# EasyEDA schematic SCH_EspBoy.json
TITLE: EspBoy; REV: 1.0; Date: 2025-10-07; Sheet: 1/1; Drawn By: Vítor Paixão
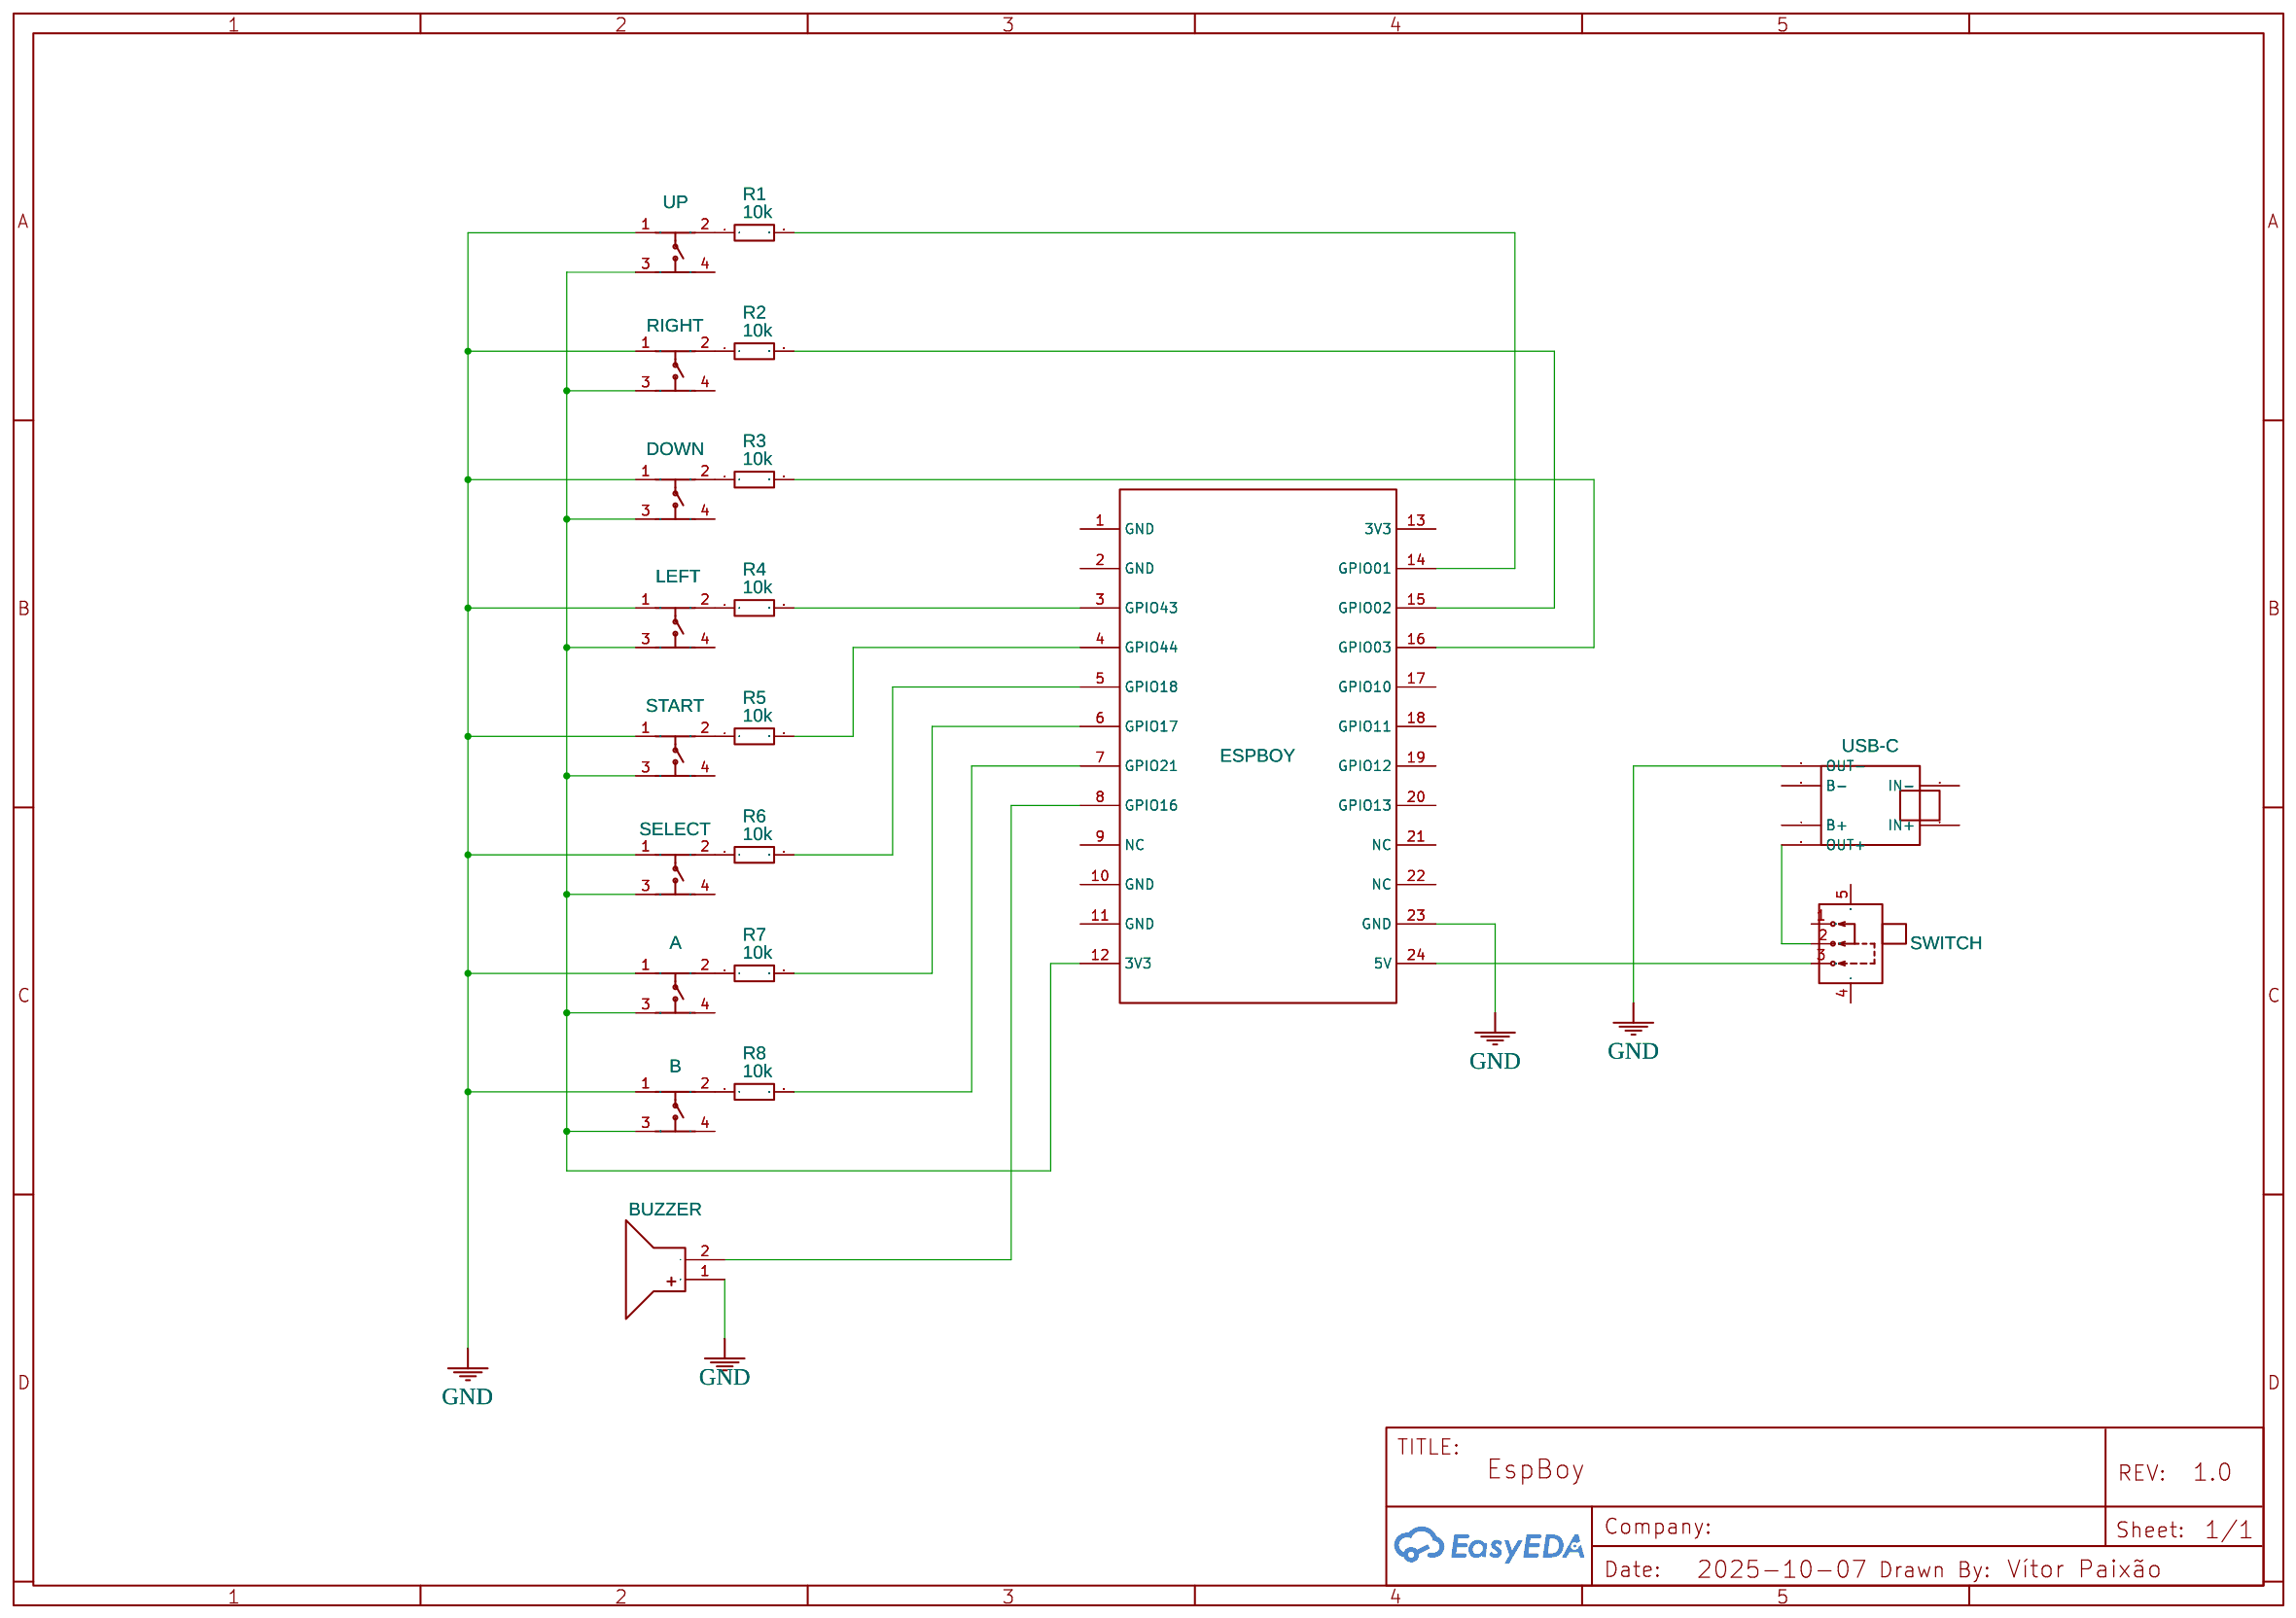
[diagram p0: schematic sheet]

## Parts
A  TC-00121FS-080E  [KEY-TH_4P-L12.0-W12.0-P5.00-LS12.5]
B  TC-00121FS-080E  [KEY-TH_4P-L12.0-W12.0-P5.00-LS12.5]
BUZZER  2207-P10MM  [BUZ-TH_BD22.0-P10.00_BUZZER_PIEZO_HX-2212]
DOWN  TC-00121FS-080E  [KEY-TH_4P-L12.0-W12.0-P5.00-LS12.5]
ESPBOY  LILYGO T-Display S3  [LILYGO T-DISPLAY]
LEFT  TC-00121FS-080E  [KEY-TH_4P-L12.0-W12.0-P5.00-LS12.5]
R1  10k  [RES-TH_BD2.2-L6.0-P10.00-D0.5]
R2  10k  [RES-TH_BD2.2-L6.0-P10.00-D0.5]
R3  10k  [RES-TH_BD2.2-L6.0-P10.00-D0.5]
R4  10k  [RES-TH_BD2.2-L6.0-P10.00-D0.5]
R5  10k  [RES-TH_BD2.2-L6.0-P10.00-D0.5]
R6  10k  [RES-TH_BD2.2-L6.0-P10.00-D0.5]
R7  10k  [RES-TH_BD2.2-L6.0-P10.00-D0.5]
R8  10k  [RES-TH_BD2.2-L6.0-P10.00-D0.5]
RIGHT  TC-00121FS-080E  [KEY-TH_4P-L12.0-W12.0-P5.00-LS12.5]
SELECT  TC-00121FS-080E  [KEY-TH_4P-L12.0-W12.0-P5.00-LS12.5]
START  TC-00121FS-080E  [KEY-TH_4P-L12.0-W12.0-P5.00-LS12.5]
SWITCH  SS12F44G5  [SW-TH_SHOU-HAN_SS12F44G4]
UP  TC-00121FS-080E  [KEY-TH_4P-L12.0-W12.0-P5.00-LS12.5]
USB-C  Módulo USB-C TP4056  [USB-C]

## Library data of the parts
A B DOWN LEFT RIGHT SELECT START UP = TC-00121FS-080E: Contributor: lcsc; Supplier: LCSC; Supplier Part: C4355204; Manufacturer: HOOYA(皓宇电子); JLCPCB Part Class: Extended Part
BUZZER = 2207-P10MM: Supplier: LCSC; Supplier Part: C49246969; Manufacturer: XHXDZ(兴华鑫); Contributor: lcsc; JLCPCB Part Class: Extended Part
ESPBOY = LILYGO T-Display S3: Manufacturer: LILYGO; Manufacturer Part: T-Display S3; link: https://www.lilygo.cc/products/t-display-s3?variant=42351558590645; Contributor: michal.bukovy.mb
R1-R8 = AXIAL-0.4: Contributor: lcsc; Supplier: LCSC; Supplier Part: C9900020985; Manufacturer: null; JLCPCB Part Class: Extended Part
SWITCH = SS12F44G5: Supplier: LCSC; Supplier Part: C22435641; Manufacturer: HanElectricity(瀚源); Contributor: lcsc; JLCPCB Part Class: Extended Part
USB-C = Módulo USB-C TP4056: Contributor: paixaodamasceno

## Nets
GND: A.1 B.1 BUZZER.1(+) DOWN.1 ESPBOY.23(GND) LEFT.1 RIGHT.1 SELECT.1 START.1 UP.1 USB-C.6(OUT-)
Net-(A-2): A.2 R7.1
Net-(A-3): A.3 B.3 DOWN.3 ESPBOY.12(3V3) LEFT.3 RIGHT.3 SELECT.3 START.3 UP.3
Net-(B-2): B.2 R8.1
Net-(BUZZER-2): BUZZER.2(-) ESPBOY.8(GPIO16)
Net-(DOWN-2): DOWN.2 R3.1
Net-(ESPBOY-3): ESPBOY.3(GPIO43) R4.2
Net-(ESPBOY-4): ESPBOY.4(GPIO44) R5.2
Net-(ESPBOY-5): ESPBOY.5(GPIO18) R6.2
Net-(ESPBOY-6): ESPBOY.6(GPIO17) R7.2
Net-(ESPBOY-7): ESPBOY.7(GPIO21) R8.2
Net-(ESPBOY-14): ESPBOY.14(GPIO01) R1.2
Net-(ESPBOY-15): ESPBOY.15(GPIO02) R2.2
Net-(ESPBOY-16): ESPBOY.16(GPIO03) R3.2
Net-(ESPBOY-24): ESPBOY.24(5V) SWITCH.3
Net-(LEFT-2): LEFT.2 R4.1
Net-(R1-1): R1.1 UP.2
Net-(R2-1): R2.1 RIGHT.2
Net-(R5-1): R5.1 START.2
Net-(R6-1): R6.1 SELECT.2
Net-(SWITCH-2): SWITCH.2 USB-C.3(OUT+)

Not connected (* = marked no-connect by the designer): A 4; B 4; DOWN 4; ESPBOY 1(GND) 2(GND) 9(NC) 10(GND) 11(GND) 13(3V3) 17(GPIO10) 18(GPIO11) 19(GPIO12) 20(GPIO13) 21(NC) 22(NC); LEFT 4; RIGHT 4; SELECT 4; START 4; SWITCH 1 4 5; UP 4; USB-C 1(IN+) 2(IN-) 4(B+) 5(B-)
